# EAGLE schematic micro (EAGLE 7.6.0)
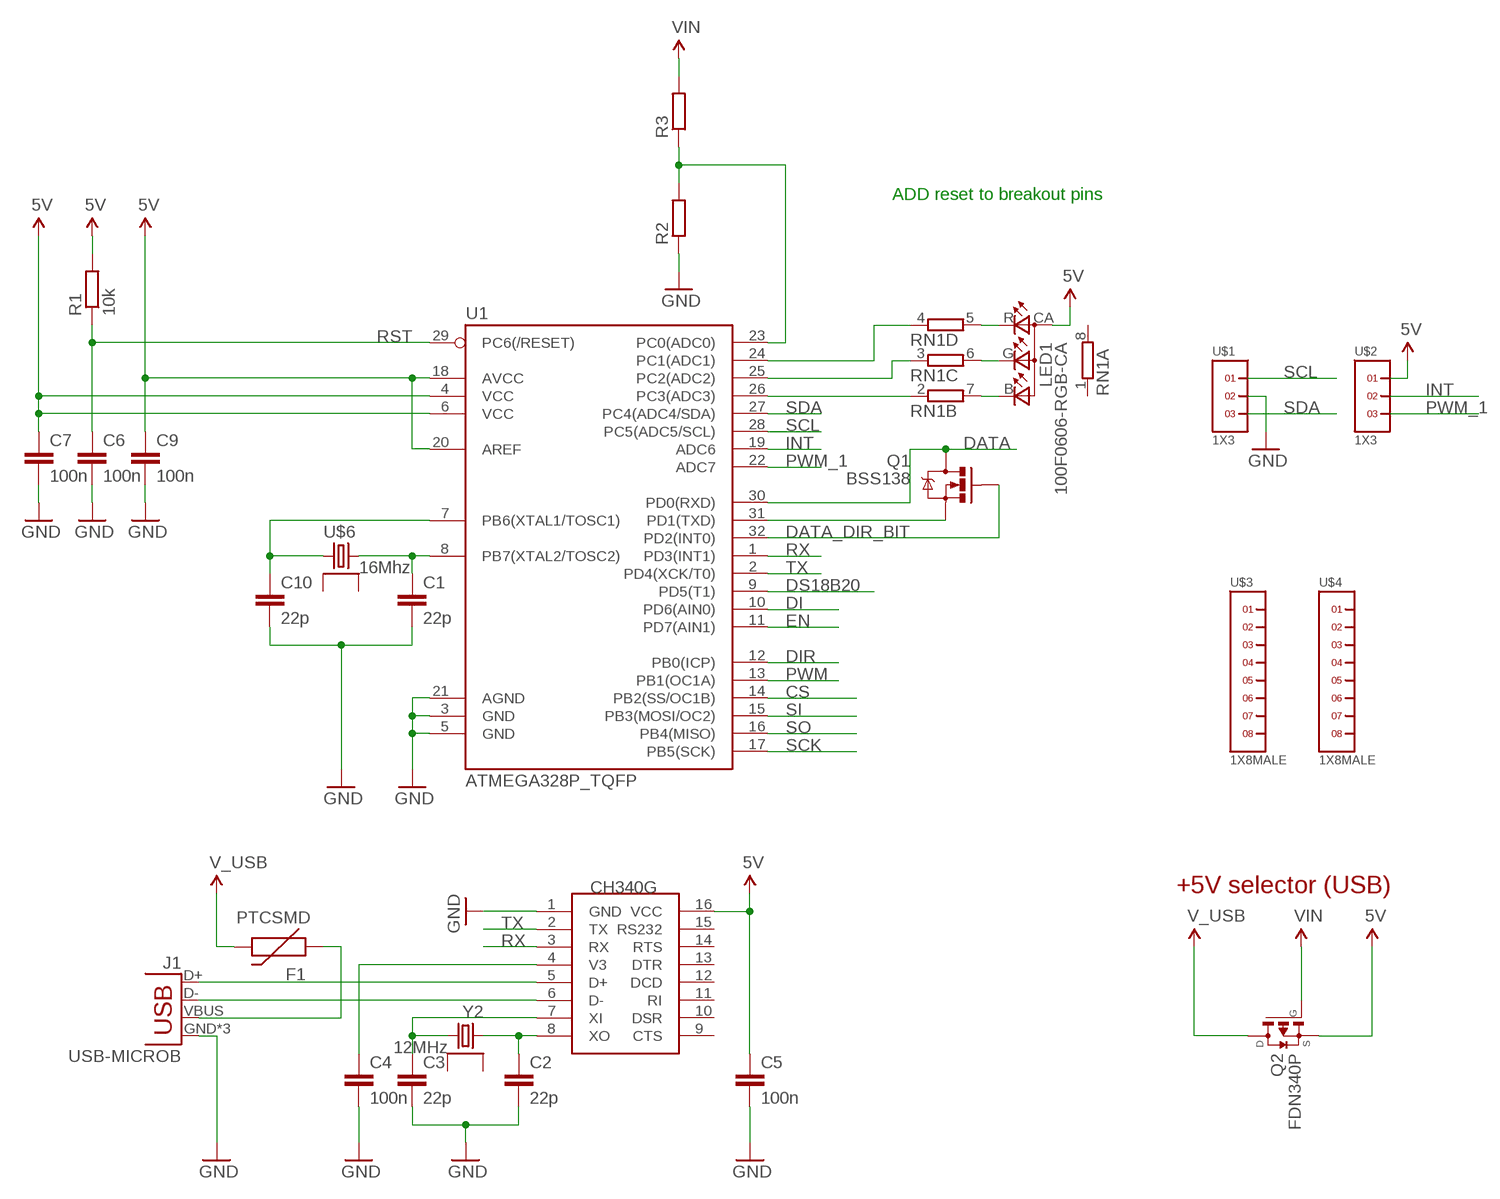
[diagram p0: schematic, sheet 1]

## Parts
C1  22p  C-EUC0402K  [C0402K]
C2  22p  C-EUC0402K  [C0402K]
C3  22p  C-EUC0402K  [C0402K]
C4  100n  C-EUC0402K  [C0402K]
C5  100n  C-EUC0402K  [C0402K]
C6  100n  C-EUC0402K  [C0402K]
C7  100n  C-EUC0402K  [C0402K]
C9  100n  C-EUC0402K  [C0402K]
C10  22p  C-EUC0402K  [C0402K]
F1  PTCSMD  [PTC-1206]
J1  USB-MICROB  [USB-MICROB]
LED1  100F0606-RGB-CA  [1616]
Q1  BSS138  MOSFET-NCHANNELBSS138  [SOT23-3]
Q2  FDN340P  [SSOT-3]
R1  10k  R-EU_R0402  [R0402]
R2  R-EU_R0402  [R0402]
R3  R-EU_R0402  [R0402]
RN1  4R-NYC124  [YC124]
U1  ATMEGA328P_TQFP  [TQFP32-08]
U$1  1X3  [1X3]
U$2  1X3  [1X3]
U$3  1X8MALE  [1X8_MALE]
U$4  1X8MALE  [1X8_MALE]
U$5  CH340G  [SOIC16]
U$6  16Mhz  GSX-331  [OSC3225]
Y2  12MHz  GSX-531  [GSX-531]

## Nets
5V: C5.1 C7.1 C9.1 LED1.CA Q2.2(S) R1.2 U1.4(VCC) U1.6(VCC) U1.18(AVCC) U1.20(AREF) U$2.1 U$5.16(VCC)
CS: U1.14(PB2(SS/OC1B))
D+: J1.D+ U$5.5(D+)
D-: J1.D- U$5.6(D-)
DATA: Q1.3(D) U1.30(PD0(RXD))
DATA_DIR_BIT: Q1.1(G) U1.32(PD2(INT0))
DI: U1.10(PD6(AIN0))
DIR: U1.12(PB0(ICP))
DS18B20: U1.9(PD5(T1))
EN: U1.11(PD7(AIN1))
GND: C1.2 C2.2 C3.2 C4.2 C5.2 C6.2 C7.2 C9.2 C10.2 J1.GND J1.MT1(GND) J1.MT2(GND) R2.1 U1.3(GND) U1.5(GND) U1.21(AGND) U$1.2 U$5.1(GND)
INT: U1.19(ADC6) U$2.2
N$1: C2.1 U$5.8(XO) Y2.P$1
N$2: C3.1 U$5.7(XI) Y2.P$3
N$3: C1.1 U1.8(PB7(XTAL2/TOSC2)) U$6.P$3
N$4: C4.1 U$5.4(V3)
N$5: C10.1 U1.7(PB6(XTAL1/TOSC1)) U$6.P$1
N$6: F1.1 J1.VBUS
N$7: Q1.2(S) U1.31(PD1(TXD))
N$8: R2.2 R3.1 U1.23(PC0(ADC0))
N$9: RN1.2 U1.26(PC3(ADC3))
N$10: RN1.3 U1.25(PC2(ADC2))
N$11: RN1.4 U1.24(PC1(ADC1))
N$13: LED1.R RN1.5
N$14: LED1.G RN1.6
N$15: LED1.B RN1.7
PWM: U1.13(PB1(OC1A))
PWM_1: U1.22(ADC7) U$2.3
RST: C6.1 R1.1 U1.29(PC6(/RESET))
RX: U1.1(PD3(INT1)) U$5.3(RX)
SCK: U1.17(PB5(SCK))
SCL: U1.28(PC5(ADC5/SCL)) U$1.1
SDA: U1.27(PC4(ADC4/SDA)) U$1.3
SI: U1.15(PB3(MOSI/OC2))
SO: U1.16(PB4(MISO))
TX: U1.2(PD4(XCK/T0)) U$5.2(TX)
V_USB: F1.2 Q2.3(D)
VIN: Q2.1(G) R3.2
Unconnected: RN1.1 RN1.8 U$3.1 U$3.2 U$3.3 U$3.4 U$3.5 U$3.6 U$3.7 U$3.8 U$4.1 U$4.2 U$4.3 U$4.4 U$4.5 U$4.6 U$4.7 U$4.8 U$5.9(CTS) U$5.10(DSR) U$5.11(RI) U$5.12(DCD) U$5.13(DTR) U$5.14(RTS) U$5.15(RS232) U$6.P$2 U$6.P$4 Y2.P$2 Y2.P$4

## Notes on the sheet
- ADD reset to breakout pins
- +5V selector (USB)

## Library data of the parts
C1-C7 C9 C10 = rcl:C-EU: CAPACITOR, European symbol
F1 = SparkFun-PowerIC:PTC: Resettable Fuse PTC Resettable Fuse. Spark Fun Electronics SKU : COM-08357; PROD_ID: RES-11150
J1 = SparkFun-Connectors:USB: USB Connectors USB-B-PTH is fully proven SKU : PRT-00139/CONN-08278 USB-miniB is fully proven SKU : PRT-00587 USB-A-PCB is untested. USB-A-H is throughly reviewed, but untested. Spark Fun Electronics SKU : PRT-00437 USB-B-SMT is throughly reviewed, but untested. Needs silkscreen touching up. USB-A-S has not been used/tested USB-MB-H has not been used/tested USB-MICROB has been used. CONN-09505; PROD_ID: CONN-09505
LED1 = 100F0606-RGB-CA:100F0606-RGB-CA: Common-anode 1616 RGB LED
Q1 = SparkFun-DiscreteSemi:MOSFET-NCHANNEL: Common NMOSFET Parts MFG P/N Store ID Prod ID FDD8780 TRANS-09984 SI7820DN TRANS-11055 FDS6630A IC-08089 2N7002PW TRANS-11151 FQP30N06L COM-10213 TRANS-10060 BSS123LT1G TRANS-08345 BSS138 TRANS-00830 BS170 2N7000; PROD_ID: TRANS-00830; VALUE: 200mA/50V
Q2 = transistor-fet:FDN340P: P-Channel MOSFET Logic Level, PowerTrench MOSFET
R1-R3 = rcl:R-EU_: RESISTOR, European symbol
RN1 = resistor-dil:4R-N: Array Chip Resistor Source: RS Component / Phycomp; OC_FARNELL: unknown; OC_NEWARK: unknown
U1 = SparkFun-DigitalIC:ATMEGA328P_TQFP; PROD_ID: IC-09069
U$1 U$2 = headers(.05in):1X3
U$3 U$4 = headers(.05in):1X8
U$5 = ch340g:CH340G
U$6 = crystals_golledge_full_v1-0:GSX-331: Crystal |SM| 3.2 x 2.5 mm | AT cut | Frequency Range 10 - 125 MHz Metal lid can be grounded to minimise EMI Seam sealed for excellent long-term stability Tight specifications available Ultra-miniature for maximum space saving Datasheet <http://www.golledge.com/docs/products/xtl_sm/gsx331.htm?src=eagle>; HEIGHT: 0.8
Y2 = crystals_golledge_full_v1-0:GSX-531: Crystal |SM| 5.0 x 3.2 mm | AT cut | Frequency Range 8 - 100 MHz Metal lid can be grounded to minimise EMI Seam seal for excellent long-term stability Tight specifications available Ultra-miniature for maximum space saving Datasheet <http://www.golledge.com/docs/products/xtl_sm/gsx531.htm?src=eagle>; HEIGHT: 0.7